# Altium schematic sheet IO_Expander.SchDoc
size A4; SheetNumber: 6; SheetTotal: 9
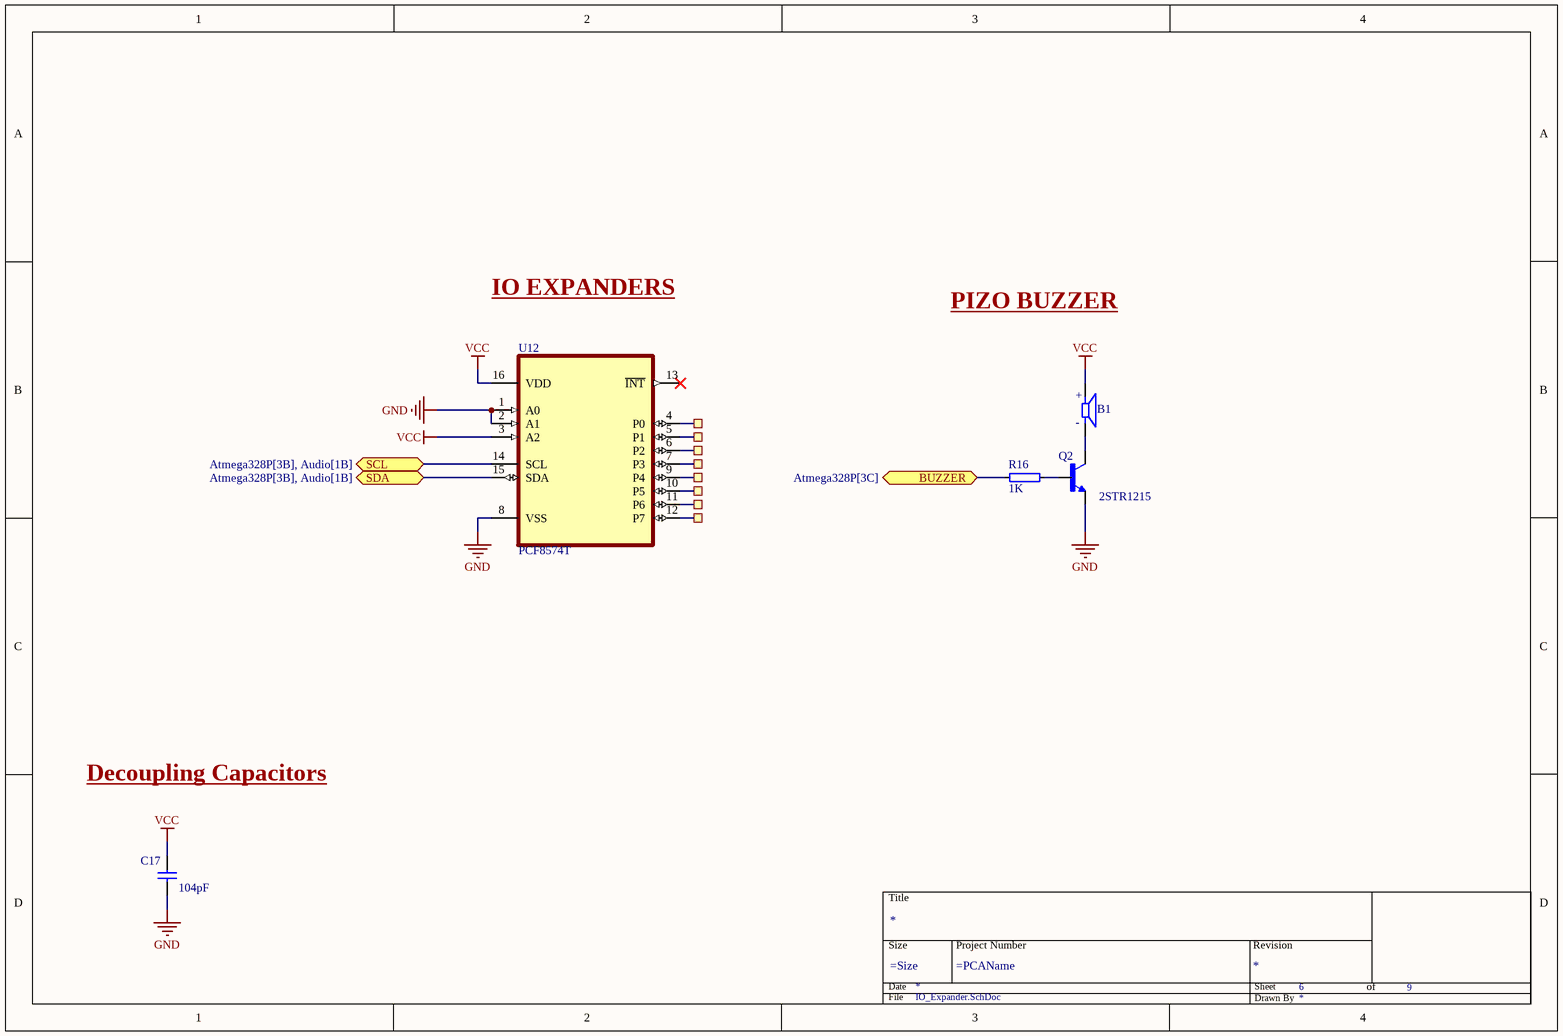
[diagram p0: IO_Expander.SchDoc]

## Parts
*  Title Block  (value not drawn)  (graphical)
B1  CST-951AP  [CUI_CST-951AP]  (value not drawn)
C17  104pF  [CAPC2012X140N]
Q2  2STR1215  [SOT95P280X125-3N]
R16  1K  [RESC2012X65N]
TP3  TP  [TESTPAD-TH]  (value not drawn)  (no BOM)
TP4  TP  [TESTPAD-TH]  (value not drawn)  (no BOM)
TP5  TP  [TESTPAD-TH]  (value not drawn)  (no BOM)
TP6  TP  [TESTPAD-TH]  (value not drawn)  (no BOM)
TP7  TP  [TESTPAD-TH]  (value not drawn)  (no BOM)
TP8  TP  [TESTPAD-TH]  (value not drawn)  (no BOM)
TP9  TP  [TESTPAD-TH]  (value not drawn)  (no BOM)
TP10  TP  [TESTPAD-TH]  (value not drawn)  (no BOM)
U12  PCF8574T  [SOIC127P1032X265-16N]

## Ports
BUZZER (bidir, see Atmega328P[3C]), SCL (bidir, see Atmega328P[3B], Audio[1B]), SDA (bidir, see Atmega328P[3B], Audio[1B])

## Nets
GND: C17.1 Q2.2(E) U12.1(A0) U12.2(A1) U12.8(VSS)
VCC: B1.P C17.2 U12.3(A2) U12.16(VDD)
BUZZER: R16.2 ; port BUZZER
SCL: U12.14(SCL) ; port SCL
SDA: U12.15(SDA) ; port SDA
NetB1_M: B1.M Q2.3(C)
NetQ2_1: Q2.1(B) R16.1
NetTP3_1: TP3.1 U12.4(P0)
NetTP4_1: TP4.1 U12.5(P1)
NetTP5_1: TP5.1 U12.6(P2)
NetTP6_1: TP6.1 U12.7(P3)
NetTP7_1: TP7.1 U12.9(P4)
NetTP8_1: TP8.1 U12.10(P5)
NetTP9_1: TP9.1 U12.11(P6)
NetTP10_1: TP10.1 U12.12(P7)

Not connected (* = marked no-connect by the designer): U12 13(~{INT})*

## Notes on the sheet
- IO EXPANDERS
- PIZO BUZZER
- Decoupling Capacitors
- (in symbol CST-951AP) +; -
- (in symbol Title Block) Title; Size; Project Number; Revision; Date; Sheet; of; File; Drawn By

## Library data of the parts
B1 = CST-951AP: 9 mm, 5 V, 85 dB, Through Hole, Magnetic Audio Transducer B; Part Number: CST-951AP; Manufacturer Part Number: CST-951AP; Pin Count: 2; Publisher: Metal Circuits; Value: CST-951AP
C17 = CAP_0805: Part Number: CAP_0805; Pin Count: 2; Publisher: Metal Circuits; Value: 104pF
Q2 = 2STR1215: Bipolar (BJT) Transistor NPN 15 V 1.5 A - 500 mW Surface Mount SOT-23-3; Manufacturer: ST; Part Number: 2STR1215; Manufacturer Part Number: 2STR1215; Pin Count: 3; Publisher: Metal Circuits; Value: 2STR1215; FootPrint Doc: SOT-23
R16 = RES_0805: RES SMD 1% 1/10W 0805; Part Number: RES_0805; Pin Count: 2; Publisher: Metal Circuits; Value: 1K; FootPrint Doc: 0805
TP3-TP10 = TESTPAD_TH: Testpoint, through hole; Part Number: Testpoint TH; Artikkelnr Noca: N.A.; Manufacturer: *; Manufacturer Part Number: *; Datasheet: *; Footprint Doc: TESTPAD-TH; LatestRevisionDate: 2009-12-12; Pin Count: 1; Publisher: Nordic Semiconductor; Published: 2009-12-12; Value: TP; Note: *; Supplier: *; Supplier part number: *; 2nd source Supplier: *; 2nd source part number: *; Artikkelnr Simpro: N.A.
U12 = PCF8574T/3,518: IC XPNDR 100KHZ I2C 16SO; Manufacturer: NXP; Part Number: PCF8574T/3,518; Manufacturer Part Number: PCF8574T/3,518; Pin Count: 16; Publisher: Metal Circuits; Value: PCF8574T; FootPrint Doc: SOIC-16